# EAGLE design Quadcopter V2 (EAGLE 7.5.0)
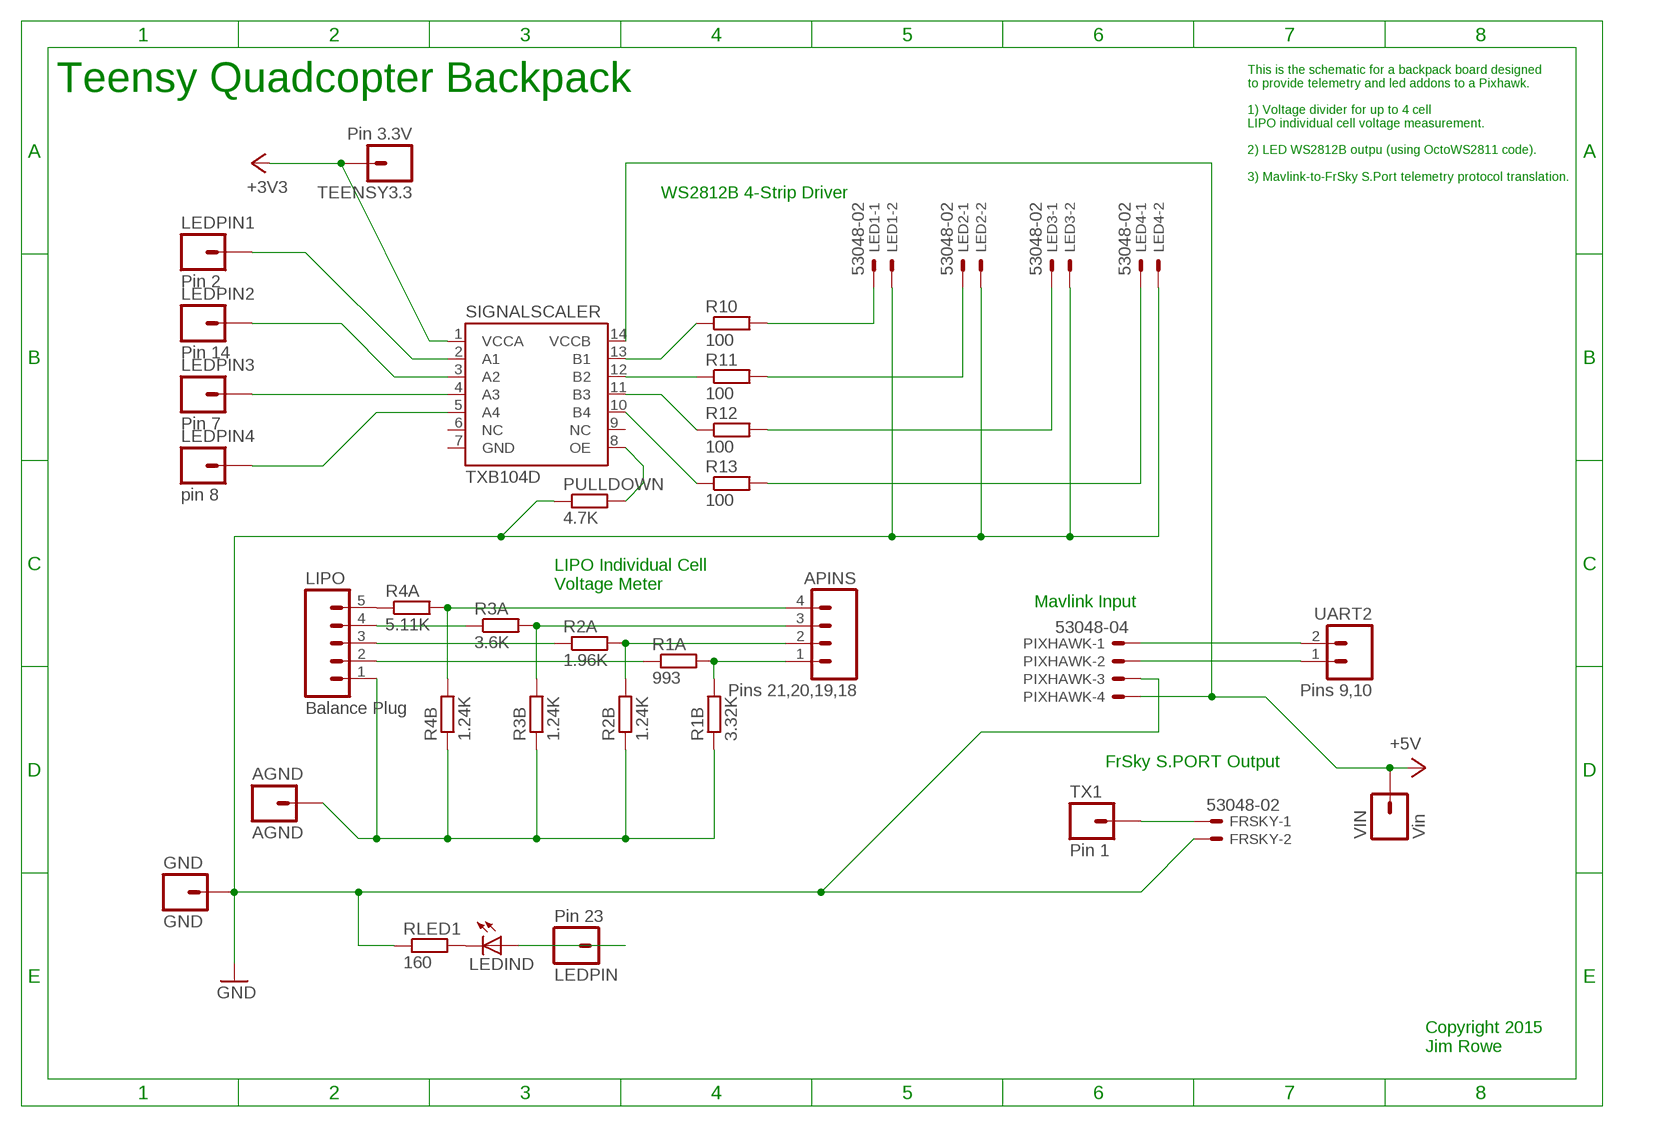
[diagram p0: schematic, sheet 1]

## Parts
AGND  AGND  M01PTH_NO_SILK_YES_STOP  [1X01_NO_SILK]
APINS  Pins 21,20,19,18  M04NO_SILK_ALL_ROUND  [1X04_NO_SILK_ALL_ROUND]
FRSKY  53048-02  [53048-02]
GND  GND  M01PTH_NO_SILK_YES_STOP  [1X01_NO_SILK]
LED1  53048-02  [53048-02]
LED2  53048-02  [53048-02]
LED3  53048-02  [53048-02]
LED4  53048-02  [53048-02]
LEDIND  LEDCHIPLED_0603  [CHIPLED_0603]
LEDPIN  Pin 23  M01PTH_NO_SILK_YES_STOP  [1X01_NO_SILK]
LEDPIN1  Pin 2  M01PTH_NO_SILK_YES_STOP  [1X01_NO_SILK]
LEDPIN2  Pin 14  M01PTH_NO_SILK_YES_STOP  [1X01_NO_SILK]
LEDPIN3  Pin 7  M01PTH_NO_SILK_YES_STOP  [1X01_NO_SILK]
LEDPIN4  pin 8  M01PTH_NO_SILK_YES_STOP  [1X01_NO_SILK]
LIPO  Balance Plug  M05LOCK_LONGPADS  [1X05_LOCK_LONGPADS]
PIXHAWK  53048-04  [53048-04]
PULLDOWN  4.7K  R-EU_R0805  [R0805]
R1A  993  R-EU_R0805  [R0805]
R1B  3.32K  R-EU_R0805  [R0805]
R2A  1.96K  R-EU_R0805  [R0805]
R2B  1.24K  R-EU_R0805  [R0805]
R3A  3.6K  R-EU_R0805  [R0805]
R3B  1.24K  R-EU_R0805  [R0805]
R4A  5.11K  R-EU_R0805  [R0805]
R4B  1.24K  R-EU_R0805  [R0805]
R10  100  R-EU_R0805  [R0805]
R11  100  R-EU_R0805  [R0805]
R12  100  R-EU_R0805  [R0805]
R13  100  R-EU_R0805  [R0805]
RLED1  160  R-EU_R0603  [R0603]
SIGNALSCALER  TXB104D  [SOIC(D)-14]
TEENSY3.3  Pin 3.3V  M01PTH_NO_SILK_YES_STOP  [1X01_NO_SILK]
TX1  Pin 1  M01PTH_NO_SILK_YES_STOP  [1X01_NO_SILK]
UART2  Pins 9,10  M021X02_NO_SILK  [1X02_NO_SILK]
VIN  Vin  M01PTH_NO_SILK_YES_STOP  [1X01_NO_SILK]

## Nets
+3V3: SIGNALSCALER.1(VCCA) TEENSY3.3.1
+5V: PIXHAWK.4 SIGNALSCALER.14(VCCB) VIN.1
GND: FRSKY.2 GND.1 LED1.2 LED2.2 LED3.2 LED4.2 PIXHAWK.3 PULLDOWN.1 RLED1.1
N$1: R10.1 SIGNALSCALER.13(B1)
N$2: R11.1 SIGNALSCALER.12(B2)
N$3: R12.1 SIGNALSCALER.11(B3)
N$4: R13.1 SIGNALSCALER.10(B4)
N$5: APINS.4 R4A.2 R4B.2
N$6: APINS.3 R3A.2 R3B.2
N$7: APINS.2 R2A.2 R2B.2
N$8: LIPO.5 R4A.1
N$9: LIPO.4 R3A.1
N$10: LIPO.3 R2A.1
N$11: LIPO.2 R1A.1
N$12: LEDPIN1.1 SIGNALSCALER.2(A1)
N$13: LEDPIN2.1 SIGNALSCALER.3(A2)
N$14: LEDPIN3.1 SIGNALSCALER.4(A3)
N$15: LEDPIN4.1 SIGNALSCALER.5(A4)
N$16: AGND.1 LIPO.1 R1B.1 R2B.1 R3B.1 R4B.1
N$17: APINS.1 R1A.2 R1B.2
N$18: LED1.1 R10.2
N$19: LED2.1 R11.2
N$20: LED3.1 R12.2
N$21: LED4.1 R13.2
N$22: PIXHAWK.1 UART2.2
N$23: PIXHAWK.2 UART2.1
N$24: LEDIND.C RLED1.2
N$25: FRSKY.1 TX1.1
N$26: PULLDOWN.2 SIGNALSCALER.8(OE)
N$27: LEDIND.A LEDPIN.1
Unconnected: SIGNALSCALER.6(NC) SIGNALSCALER.9(NC)

## Notes on the sheet
- Teensy Quadcopter Backpack
- This is the schematic for a backpack board designed
  to provide telemetry and led addons to a Pixhawk.
  
  1) Voltage divider for up to 4 cell
  LIPO individual cell voltage measurement.
  
  2) LED WS2812B outpu (using OctoWS2811 code).
  
  3) Mavlink-to-FrSky S.Port telemetry protocol translation.
- WS2812B 4-Strip Driver
- LIPO Individual Cell
  Voltage Meter
- Mavlink Input
- FrSky S.PORT Output
- Copyright 2015
  Jim Rowe

## Power pins joined to a net without a drawn wire
GND: SIGNALSCALER.7(GND)

## Library data of the parts
AGND GND LEDPIN LEDPIN1-LEDPIN4 TEENSY3.3 TX1 VIN = SparkFun-Connectors:M01: Header 1 Standard 1-pin 0.1" header. Use with straight break away headers (SKU : PRT-00116), right angle break away headers (PRT-00553), swiss pins (PRT-00743), machine pins (PRT-00117), and female headers (PRT-00115). SMTSO-256-ET is a "flush mount" nut for a 4-40 screw. The older package used to be too tight, and did not allow it to sit properly thru the drill hit. The latest (0.165DIA) fits nice and snug.
APINS = SparkFun-Connectors:M04: Header 4 Standard 4-pin 0.1" header. Use with straight break away headers (SKU : PRT-00116), right angle break away headers (PRT-00553), swiss pins (PRT-00743), machine pins (PRT-00117), and female headers (PRT-00115). Molex polarized connector foot print use with SKU : PRT-08231 with associated crimp pins and housings. 1MM SMD Version SKU: PRT-10208
FRSKY LED1-LED4 = con-molex:53?-02: CONNECTOR wire to board 1.25 mm (.049 inch) pitch header; MF: MOLEX; MPN: 53048-0210; OC_FARNELL: 1012259; OC_NEWARK: 57H4718
LEDIND = led:LED: LED OSRAM: - CHIPLED LG R971, LG N971, LY N971, LG Q971, LY Q971, LO R971, LY R971 LH N974, LH R974 LS Q976, LO Q976, LY Q976 LO Q996 - Hyper CHIPLED LW Q18S LB Q993, LB Q99A, LB R99A - SideLED LS A670, LO A670, LY A670, LG A670, LP A670 LB A673, LV A673, LT A673, LW A673 LH A674 LY A675 LS A676, LA A676, LO A676, LY A676, LW A676 LS A679, LY A679, LG A679 - Hyper Micro SIDELED® LS Y876, LA Y876, LO Y876, LY Y876 LT Y87S - SmartLED LW L88C, LW L88S LB L89C, LB L89S, LG L890 LS L89K, LO L89K, LY L89K LS L896, LA L896, LO L896, LY L896 - TOPLED LS T670, LO T670, LY T670, LG T670, LP T670 LSG T670, LSP T670, LSY T670, LOP T670, LYG T670 LG T671, LOG T671, LSG T671 LB T673, LV T673, LT T673, LW T673 LH T674 LS T676, LA T676, LO T676, LY T676, LB T676, LH T676, LSB T676, LW T676 LB T67C, LV T67C, LT T67C, LS T67K, LO T67K, LY T67K, LW E67C LS E67B, LA E67B, LO E67B, LY E67B, LB E67C, LV E67C, LT E67C LW T67C LS T679, LY T679, LG T679 LS T770, LO T770, LY T770, LG T770, LP T770 LB T773, LV T773, LT T773, LW T773 LH T774 LS E675, LA E675, LY E675, LS T675 LS T776, LA T776, LO T776, LY T776, LB T776 LHGB T686 LT T68C, LB T68C - Hyper Mini TOPLED® LB M676 - Mini TOPLED Santana® LG M470 LS M47K, LO M47K, LY M47K Source: http://www.osram.convergy.de LUXEON: - LUMILED® LXK2-PW12-R00, LXK2-PW12-S00, LXK2-PW14-U00, LXK2-PW14-V00 LXK2-PM12-R00, LXK2-PM12-S00, LXK2-PM14-U00 LXK2-PE12-Q00, LXK2-PE12-R00, LXK2-PE12-S00, LXK2-PE14-T00, LXK2-PE14-U00 LXK2-PB12-K00, LXK2-PB12-L00, LXK2-PB12-M00, LXK2-PB14-N00, LXK2-PB14-P00, LXK2-PB14-Q00 LXK2-PR12-L00, LXK2-PR12-M00, LXK2-PR14-Q00, LXK2-PR14-R00 LXK2-PD12-Q00, LXK2-PD12-R00, LXK2-PD12-S00 LXK2-PH12-R00, LXK2-PH12-S00 LXK2-PL12-P00, LXK2-PL12-Q00, LXK2-PL12-R00 Source: www.luxeon.com KINGBRIGHT: KA-3528ASYC Source: www.kingbright.com
LIPO = SparkFun-Connectors:M05: Header 5 Standard 5-pin 0.1" header. Use with straight break away headers (SKU : PRT-00116), right angle break away headers (PRT-00553), swiss pins (PRT-00743), machine pins (PRT-00117), and female headers (PRT-00115). Molex polarized connector foot print use with SKU : PRT-08230 with associated crimp pins and housings.
PIXHAWK = con-molex:53?-04: CONNECTOR wire to board 1.25 mm (.049 inch) pitch header; MF: MOLEX; MPN: 53048-0410; OC_FARNELL: 1462887; OC_NEWARK: 57H4721
PULLDOWN R1A R1B R2A R2B R3A R3B R4A R4B R10-R13 RLED1 = resistor:R-EU_: RESISTOR, European symbol
SIGNALSCALER = ti_txb0104:TXB104
UART2 = SparkFun-Connectors:M02: Standard 2-pin 0.1" header. Use with - straight break away headers ( PRT-00116) - right angle break away headers (PRT-00553) - swiss pins (PRT-00743) - machine pins (PRT-00117) - female headers (PRT-00115) Molex polarized connector foot print use with: PRT-08233 with associated crimp pins and housings. 2.54_SCREWTERM for use with PRT-10571. 3.5mm Screw Terminal footprints for PRT-08084 5mm Screw Terminal footprints for use with PRT-08432

## Board
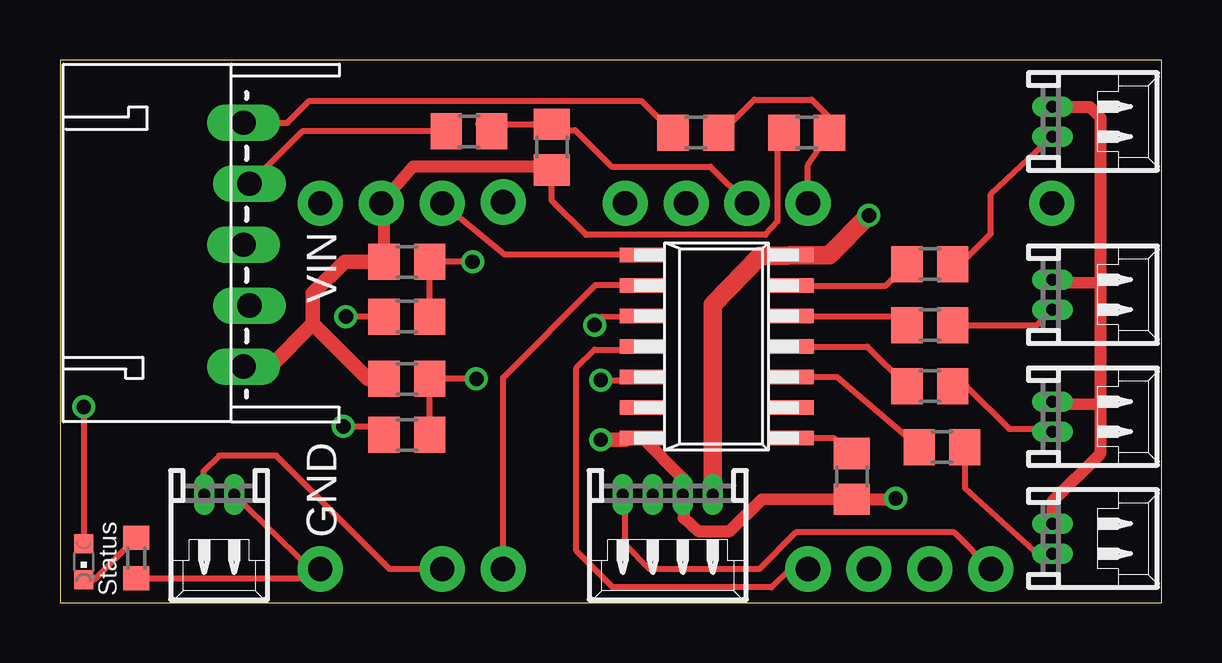
[diagram p1: board, top side]
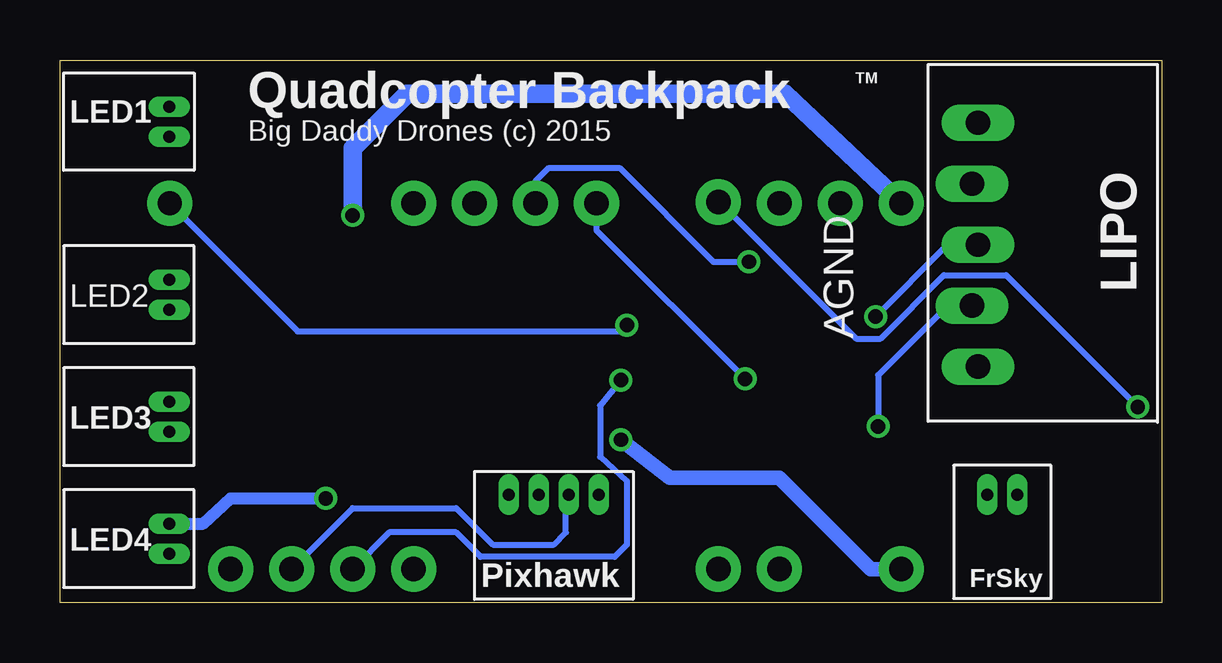
[diagram p2: board, bottom side, seen from below]

Size 45.9 x 22.61 mm. Coordinates in mm from the lower left corner, seen from the top.
Outline: 0,0 45.9,0 45.9,22.61 0,22.61 0,0
Copper layers (1*16): Top 0.0356mm / dielectric 1.5011mm / Bottom 0.0356mm
Design rules "LaenPCBOrder (1)": minimum track width 6mil, minimum drill 13mil, track to track 6mil, track to pad 6mil, pad to pad 6mil, via to via 6mil, smd to smd 6mil, copper to edge 15mil, drill to drill 6mil, minimum pad ring 7mil, minimum via ring 7mil, stop-mask expansion 3mil, vias tented up to drill 0mil, thermal gap 10mil

### Footprints (pad centres in the part's own frame; a part is rotated, then mirrored left to right if it is on the bottom)
1X01_NO_SILK = drill 1.016 pad 1.88: 1 0,0
1X04_NO_SILK_ALL_ROUND = drill 1.016 pad 1.88: 1 0,0; 2 2.54,0; 3 5.08,0; 4 7.62,0
53048-02 = drill 0.5 pad 0.698 long: 1 0.625,-1.25; 2 -0.625,-1.25
CHIPLED_0603 = smd 0.8 x 0.8: A 0,-0.75; C 0,0.75
1X05_LOCK_LONGPADS = drill 1.016 long: 1 0,0; 2 2.54,-0.254; 3 5.08,0; 4 7.62,-0.254; 5 10.16,0
53048-04 = drill 0.5 pad 0.698 long: 1 1.875,-1.25; 2 0.625,-1.25; 3 -0.625,-1.25; 4 -1.875,-1.25
R0805 = smd 1.3 x 1.5: 1 -0.95,0; 2 0.95,0
R0603 = smd 1 x 1.1: 1 -0.85,0; 2 0.85,0
SOIC(D)-14 = smd 0.61 x 1.93: 1 -3.81,-3.076; 2 -2.54,-3.076; 3 -1.27,-3.076; 4 0,-3.076; 5 1.27,-3.076; 6 2.54,-3.076; 7 3.81,-3.076; 8 3.81,3.076; 9 2.54,3.076; 10 1.27,3.076; 11 0,3.076; 12 -1.27,3.076; 13 -2.54,3.076; 14 -3.81,3.076
1X02_NO_SILK = drill 1.016 pad 1.88: 1 0,0; 2 2.54,0

### Placement (x,y rotation side)
AGND  13.39,16.64 0 top
APINS  23.55,16.64 0 top
FRSKY  6.63,3.25 180 top
GND  10.85,1.4 0 top
LED1  42.6,20.04 270 top
LED2  42.6,12.83 270 top
LED3  42.6,7.75 270 top
LED4  42.6,2.67 270 top
LEDIND  0.99,1.7 180 top
LEDPIN  18.47,16.69 0 top
LEDPIN1  18.47,1.4 0 top
LEDPIN2  41.33,16.64 0 top
LEDPIN3  31.17,1.4 0 top
LEDPIN4  33.71,1.4 0 top
LIPO  7.65,9.83 90 top
PIXHAWK  25.32,3.25 180 top
PULLDOWN  32.99,5.26 90 top
R1A  14.45,6.98 0 top
R1B  14.45,9.32 0 top
R2A  14.45,11.91 0 top
R2B  14.45,14.2 0 top
R3A  17.04,19.63 0 top
R3B  20.5,18.97 90 top
R4A  26.49,19.58 0 top
R4B  31.11,19.58 0 top
R10  36.25,14.1 0 top
R11  36.25,11.56 0 top
R12  36.25,9.02 0 top
R13  36.75,6.48 0 top
RLED1  3.17,1.85 90 top
SIGNALSCALER  27.36,10.67 270 top
TEENSY3.3  15.93,16.64 0 top
TX1  15.93,1.4 0 top
UART2  36.25,1.4 0 top
VIN  10.85,16.64 0 top

### Tracks (layer width: path | path; a pad name or v marks a point on that pad's centre or on a via)
+3V3
  Top 0.254: TEENSY3.3.1 18.52,14.5 24.25,14.5 SIGNALSCALER.1
+5V  (via drill 0.6)
  Top 0.254: 30.3,14.45 SIGNALSCALER.14
  Top 0.762: PIXHAWK.4 27.2,12.42 29.18,14.45 30.3,14.45 | SIGNALSCALER.14 32.05,14.48 v33.71,16.13
  Bottom 0.762: v33.71,16.13 33.71,18.92 31.42,21.21 15.67,21.21 VIN.1
GND  (via drill 0.6)
  Top 0.254: 23.55,6.78 24.15,6.73 SIGNALSCALER.7 | FRSKY.2 10.46,1.4 GND.1 10.45,1 RLED1.1
  Top 0.508: LED2.2 41.85,13.36 43.36,13.34 | 43.36,13.34 43.36,20.19 42.9,20.65 LED1.2 | LED3.2 41.6,8.28 43.36,8.26 | 43.36,8.26 43.36,13.34 | 43.36,8.26 43.36,6.22 41.35,4.21 LED4.2 | SIGNALSCALER.7 25.95,5.19 PIXHAWK.3 25.98,3.78 25.98,3.53 26.59,2.97 27.91,2.97 29.23,4.29 PULLDOWN.1 34.86,4.31 v34.82,4.34
  Top 0.61: v22.53,6.78 23.55,6.78
  Bottom 0.508: LED4.2 39.94,3.29 38.79,4.34 v34.82,4.34
  Bottom 0.61: GND.1 12.12,1.4 15.93,5.21 20.5,5.21 v22.53,6.78
N$1
  Top 0.254: SIGNALSCALER.13 34.41,13.21 R10.1
N$2
  Top 0.254: SIGNALSCALER.12 34.91,11.94 R11.1
N$3
  Top 0.254: SIGNALSCALER.11 33.65,10.67 R12.1
N$4
  Top 0.254: SIGNALSCALER.10 32.38,9.4 R13.1
N$5
  Top 0.254: APINS.4 31.17,18.23 R4B.2 32.03,19.62 32.03,20.24 31.32,20.95 28.93,20.95 27.56,19.58 R4A.2
N$6
  Top 0.254: R3A.2 17.41,19.94 R3B.2 20.92,19.68 21.46,19.68 22.99,18.16 27.1,18.16 APINS.3
N$7  (via drill 0.6)
  Top 0.254: R2A.2 R2B.2 v17.2,14.2
  Bottom 0.254: APINS.2 26.09,17.55 25.53,18.11 22.58,18.11 18.67,14.2 v17.2,14.2
N$8
  Top 0.254: LIPO.5 9.47,19.99 10.39,20.9 24.22,20.9 R4A.1
N$9
  Top 0.254: R3A.1 10.08,19.63 LIPO.4
N$10  (via drill 0.6)
  Top 0.254: R2A.1 v11.91,11.91
  Bottom 0.254: v11.91,11.91 8.97,14.86 7.7,14.86 LIPO.3
N$11  (via drill 0.6)
  Top 0.254: v11.81,7.34 13.15,7.34 R1A.1
  Bottom 0.254: LIPO.2 8.92,12.37 11.81,9.47 v11.81,7.34
N$12
  Top 0.254: 24.15,13.08 SIGNALSCALER.2 24.25,13.23 22.33,13.23 18.47,9.37 LEDPIN1.1
N$13  (via drill 0.6)
  Top 0.254: v22.28,11.56 22.58,11.91 SIGNALSCALER.3
  Bottom 0.254: LEDPIN2.1 35.99,11.3 22.53,11.3 v22.28,11.56
N$14
  Top 0.254: SIGNALSCALER.4 24.15,10.54 22.28,10.54 21.51,9.78 21.51,2.16 23.04,0.64 29.64,0.64 30.4,1.4 LEDPIN3.1
N$15  (via drill 0.6)
  Top 0.254: v22.53,9.27 24.15,9.27 SIGNALSCALER.5
  Bottom 0.254: v22.53,9.27 23.39,8.2 23.39,6.07 22.28,5.05 22.28,2.41 22.78,1.91 28.37,1.91 29.39,2.92 32.18,2.92 LEDPIN4.1
N$16
  Top 0.254: R4B.1 29.91,19.6 29.9,18.16 29.9,15.88 29.39,15.32 21.92,15.32 20.5,16.74 R3B.1
  Top 0.508: R2B.1 13.5,16.52 AGND.1 14.71,18.16 20.51,18.16
  Top 0.61: R2B.1 11.86,14.2 10.54,12.88 10.54,11.61 | 20.51,18.16 R3B.1 | LIPO.1 8.76,9.83 10.54,11.61 | R1B.1 12.83,9.32 10.54,11.61
N$17  (via drill 0.6)
  Top 0.254: R1A.2 R1B.2 v17.35,9.32
  Bottom 0.254: APINS.1 23.55,15.52 v17.35,9.32
N$18
  Top 0.254: 37.52,14.1 38.79,15.37 38.79,17.01 LED1.1
  Top 0.406: R10.2 37.52,14.1
N$19
  Top 0.254: R11.2 40.7,11.56 LED2.1
N$20
  Top 0.254: R12.2 37.77,9.02 39.55,7.24 41.23,7.24
  Top 0.406: 41.23,7.24 LED3.1
N$21
  Top 0.254: R13.2 37.7,4.76 40.56,2.16 41.23,2.16
  Top 0.406: 41.23,2.16 LED4.1
N$22
  Top 0.254: UART2.2 37.26,2.92 30.66,2.92 29.13,1.4 24.56,1.4 23.55,2.41 23.55,3.82 PIXHAWK.1
N$23
  Bottom 0.254: UART2.1 33.71,3.94 29.39,3.94 27.86,2.41 25.32,2.41 24.82,2.92 24.82,3.8 PIXHAWK.2
N$24
  Top 0.254: LEDIND.C 1.42,0.95 RLED1.2
N$25
  Top 0.254: TX1.1 13.74,1.4 9.02,6.12 6.63,6.12 5.97,5.46 5.97,4.64 FRSKY.1
N$26
  Top 0.254: SIGNALSCALER.8 32.24,6.86 PULLDOWN.2
N$27  (via drill 0.6)
  Top 0.254: v0.99,8.15 LEDIND.A
  Bottom 0.254: LEDPIN.1 18.41,16.69 12.73,11 11.71,11 9.07,13.64 6.48,13.64 v0.99,8.15

### Text on the board
tNames: Status
bNames: TM | Quadcopter Backpack | LED1 | Big Daddy Drones (c) 2015 | LIPO | LED2 | AGND | LED3 | LED4 | FrSky | Pixhawk